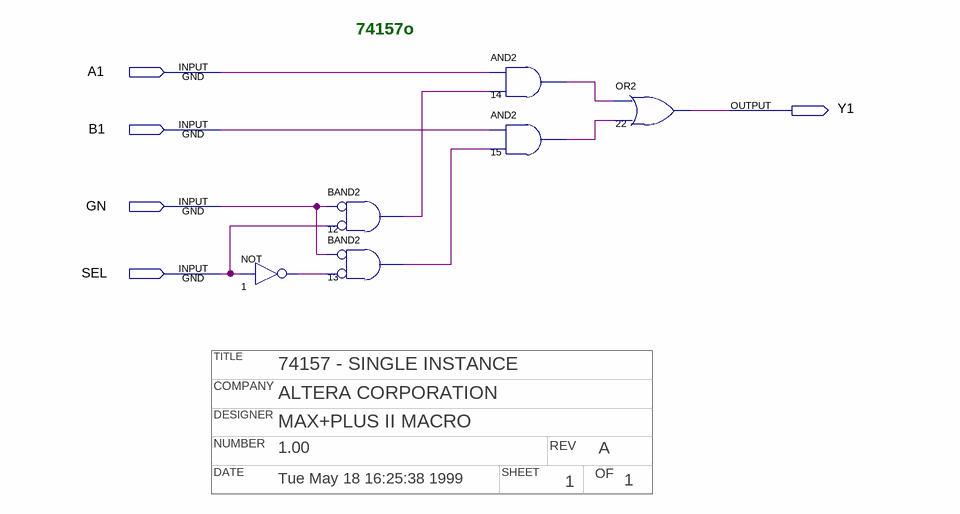
[diagram p0: schematic sheet]
// Quartus schematic 74157o.bdf as structural Verilog: 6 symbols, 5 pins
// Title block: TITLE: 74157 - SINGLE INSTANCE; COMPANY: ALTERA CORPORATION; DESIGNER: MAX+PLUS II MACRO; NUMBER: 1.00; REV: A; DATE: Tue May 18 16:25:38 1999; SHEET: 1; OF: 1
module \74157o  (
  input  A1,
  input  B1,
  input  GN,
  input  SEL,
  output Y1
);

  wire n1_out, n12_out, n13_out, n14_out, n15_out;

  not u_1 (n1_out, SEL);
  and u_12 (n12_out, ~GN, ~SEL);  // BAND2
  and u_13 (n13_out, ~GN, ~n1_out);  // BAND2
  and u_14 (n14_out, A1, n12_out);
  and u_15 (n15_out, B1, n13_out);
  or u_22 (Y1, n14_out, n15_out);

  // Notes on the sheet:
  //   74157o
endmodule
